# Altium schematic sheet Conectores.SchDoc: GRUPO ALTECH
size A3; DocumentNumber: GA0070; SheetNumber: 3; SheetTotal: 4
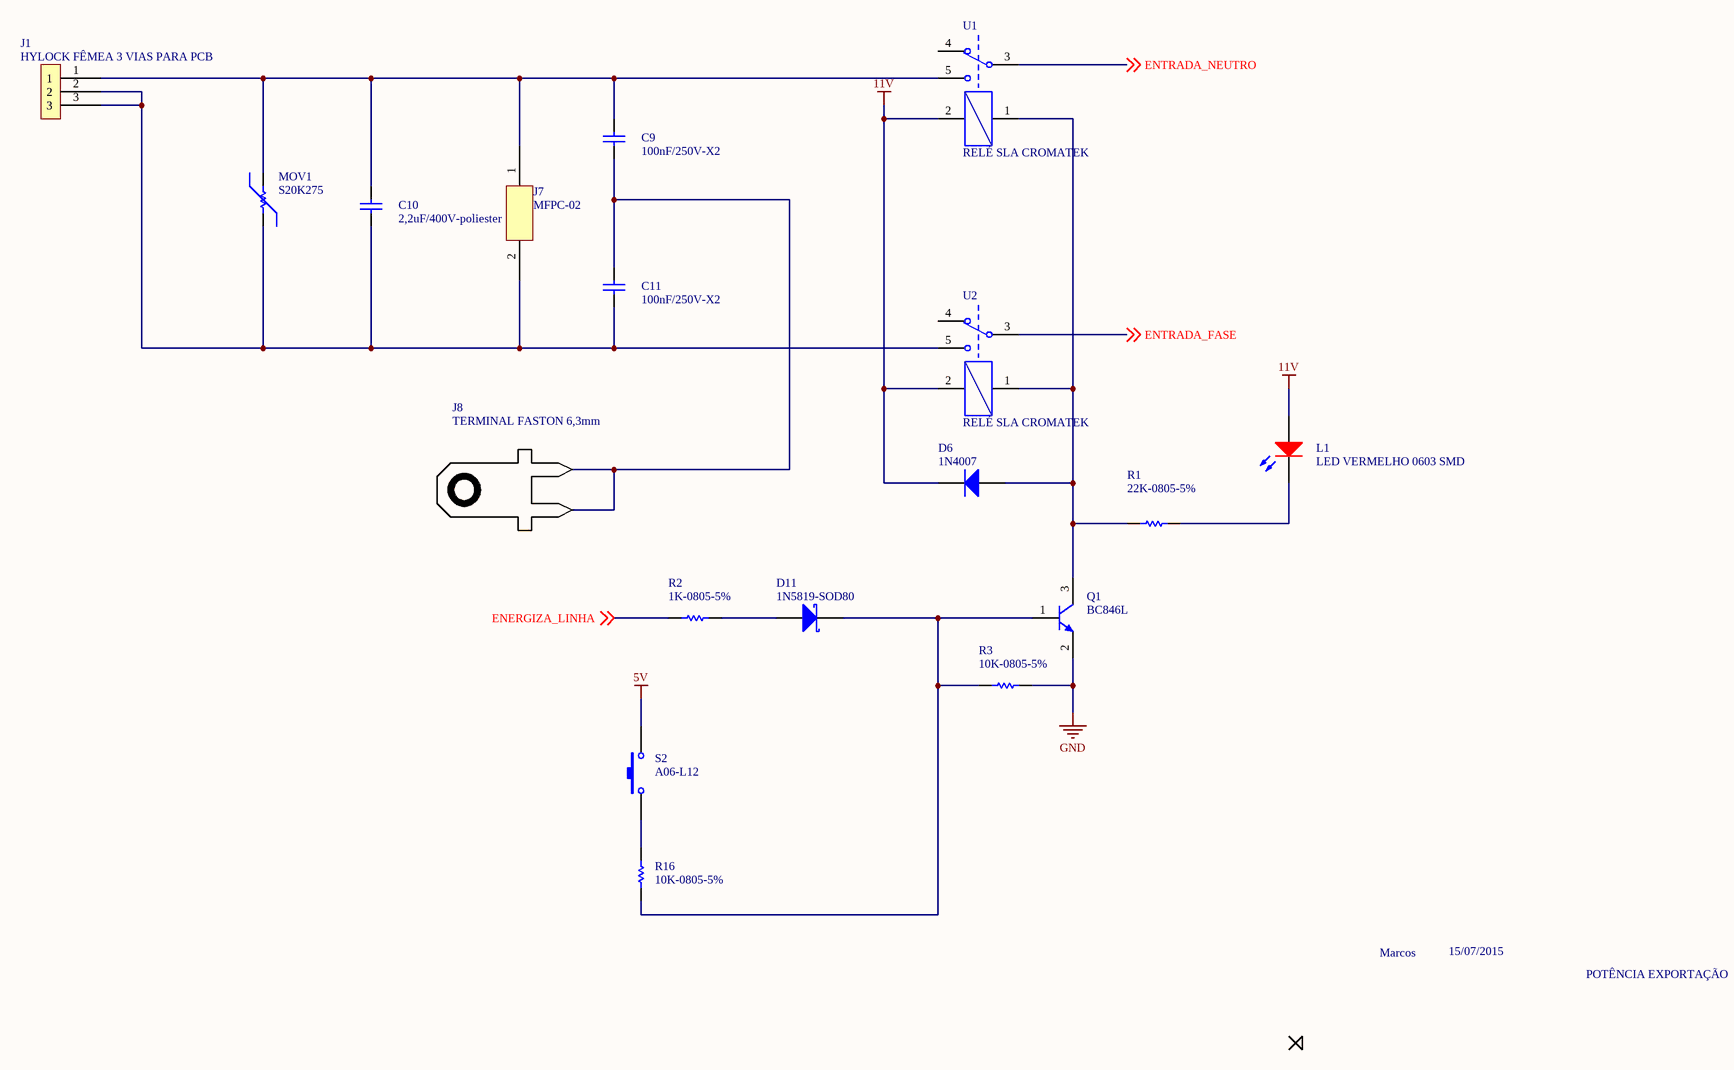
[diagram p0: Conectores.SchDoc]

## Parts
C9  100nF/250V-X2  [CAP-250V-PS]
C10  2,2uF/400V-poliester  [CAPACITOR H4]
C11  100nF/250V-X2  [CAP-250V-PS]
D6  1N4007  [SMA DIODES]
D11  1N5819-SOD80  [MINIMLEF/SOD80 - REVISADO ONDA]
J1  HYLOCK FÊMEA 3 VIAS PARA PCB  [CONECTOR HYLOCK 3 VIAS]
J7  MFPC-02  [MFPC-02]
J8  TERMINAL FASTON 6,3mm  [TERMINAL FASTON]
L1  LED VERMELHO 0603 SMD  [LED 1206]
MOV1  S20K275  [VARISTOR 20mm]
Q1  BC846L  [SOT23 - REVISADO ONDA]
R1  22K-0805-5%  [0805-REVISADO ONDA]
R2  1K-0805-5%  [0805-REVISADO ONDA]
R3  10K-0805-5%  [0805-REVISADO ONDA]
R16  10K-0805-5%  [0805-REVISADO ONDA]
S2  A06-L12  [CHAVE_A06]
U1  RELÉ SLA CROMATEK  [RELE SLA CROMATEK]
U2  RELÉ SLA CROMATEK  [RELE SLA CROMATEK]

## Nets
5V: S2.2
11V: D6.2(K) L1.1(A) U1.2(A2) U2.2(A2)
GND: Q1.2(E) R3.2
ENERGIZA_LINHA: R2.1 ; off-sheet ENERGIZA_LINHA
ENTRADA_FASE: U2.3 ; off-sheet ENTRADA_FASE
ENTRADA_NEUTRO: U1.3 ; off-sheet ENTRADA_NEUTRO
NetC9_1: C9.1 C11.2 J8.1 J8.2
NetC9_2: C9.2 C10.2 J1.1 J7.1 MOV1.2 U1.5
NetC10_1: C10.1 C11.1 J1.2 J1.3 J7.2 MOV1.1 U2.5
NetD6_1: D6.1(A) Q1.3(C) R1.1 U1.1(A1) U2.1(A1)
NetD11_1: D11.1(A) R2.2
NetD11_2: D11.2(K) Q1.1(B) R3.1 R16.1
NetL1_2: L1.2(K) R1.2
NetR16_2: R16.2 S2.1

Not connected (* = marked no-connect by the designer): U1 4; U2 4

## Notes on the sheet
- Marcos
- 15/07/2015
- POTÊNCIA EXPORTAÇÃO
- NOME
- DATA
- CLIENTE
- PROJETO
- desenho
- verif.
- aprov.
- TAMANHO
- CODIGO
- Todas as informações disponíveis
- não devem ser divulgadas,
- em parte ou todo.
- www.dextro-st.com.br
- CIRCUITO IMPRESSO
- MONTAGEM ELETRÔNICA
- A4
- de

## Library data of the parts
C9-C11 = 100nF/50-0805-NPO: 100nF/50V-0805; ERP: 104.11.005
J1 = PCMC2-3
J7 = MFPL-02
Q1 = BC846: ERP: 106.22.001
R2 = 10K-0805-5%: ERP: 102.11.054
R16 = 1K-0805-5%: ERP: 102.11.042
D6 = 1N4007: ERP: 120.18.001
D11 = 1N5819-SOD80: ERP: 121.18.003
J8 = TERMINAL FASTON 6,3mm: ERP: 431.00.010
L1 = LED VERMELHO 0603 SMD: ERP: 124.02.010
R1 = 22K-0805-5%: ERP: 102.11.058
R3 = 10K-0805-5%: ERP: 102.11.054
S2 = A06-L12: ERP: 136.00.001